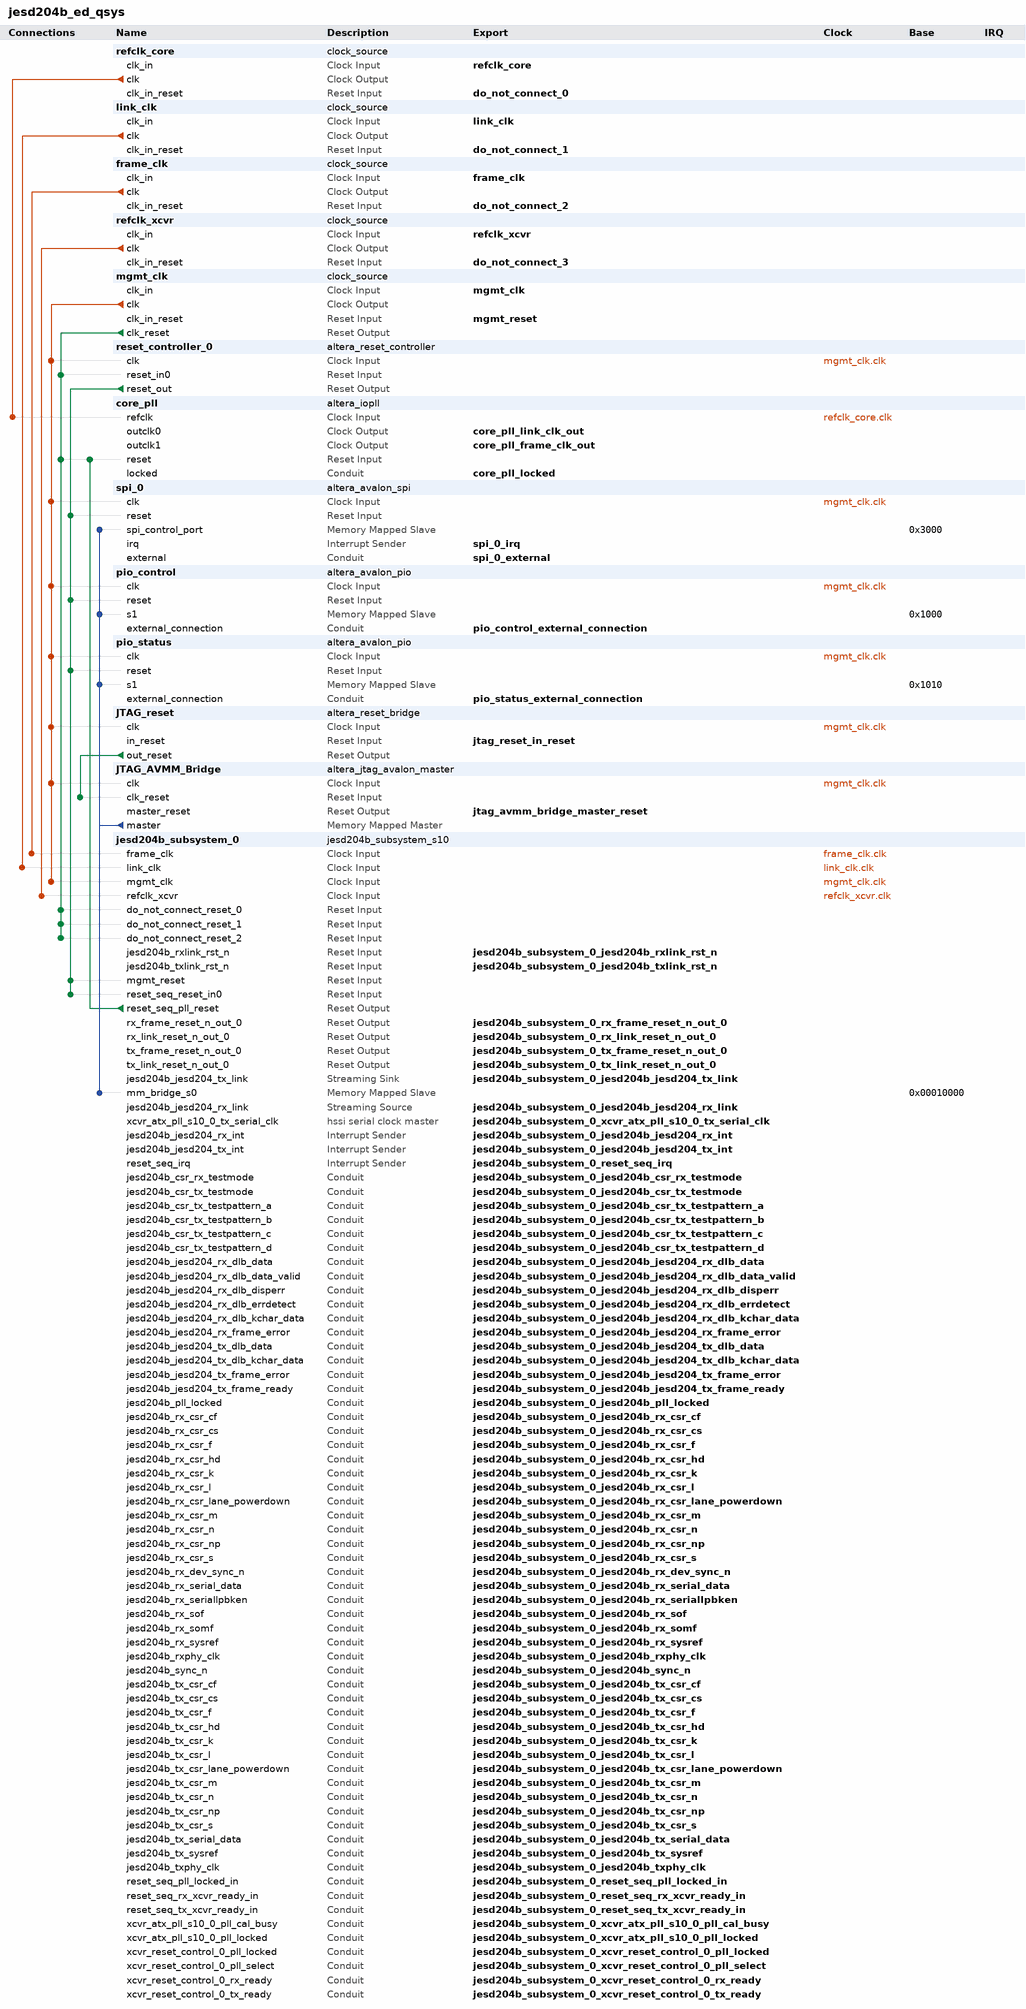
[diagram p0: system contents]
# Platform Designer (Qsys) system jesd204b_ed_qsys, Stratix 10 1SG280LN3F43E1VG
# Parameters at their usual value, and those the tool derives, are not listed.
package require -exact qsys 1.0
create_system jesd204b_ed_qsys
set_project_property DEVICE_FAMILY {Stratix 10}
set_project_property DEVICE 1SG280LN3F43E1VG

add_component refclk_core ip/jesd204b_ed_qsys/jesd204b_ed_qsys_clk_0.ip clock_source refclk_core 
load_component refclk_core
set_component_parameter_value clockFrequency 153600000
set_component_parameter_value resetSynchronousEdges DEASSERT
save_component

add_component link_clk ip/jesd204b_ed_qsys/jesd204b_ed_qsys_clk_1.ip clock_source link_clk 
load_component link_clk
set_component_parameter_value clockFrequency 153600000
set_component_parameter_value resetSynchronousEdges DEASSERT
save_component

add_component frame_clk ip/jesd204b_ed_qsys/jesd204b_ed_qsys_clk_2.ip clock_source frame_clk 
load_component frame_clk
set_component_parameter_value clockFrequency 153600000
set_component_parameter_value resetSynchronousEdges DEASSERT
save_component

add_component refclk_xcvr ip/jesd204b_ed_qsys/jesd204b_ed_qsys_clk_4.ip clock_source refclk_xcvr 
load_component refclk_xcvr
set_component_parameter_value clockFrequency 153600000
save_component

add_component mgmt_clk ip/jesd204b_ed_qsys/jesd204b_ed_qsys_clk_3.ip clock_source mgmt_clk 
load_component mgmt_clk
set_component_parameter_value clockFrequency 100000000
set_component_parameter_value resetSynchronousEdges DEASSERT
save_component

add_component reset_controller_0 ip/jesd204b_ed_qsys/jesd204b_ed_qsys_reset_controller_0.ip altera_reset_controller reset_controller_0 16.1
load_component reset_controller_0
set_component_parameter_value NUM_RESET_INPUTS 1
set_component_parameter_value SYNC_DEPTH 2
set_component_parameter_value ADAPT_RESET_REQUEST 0
save_component

add_component core_pll ip/jesd204b_ed_qsys/jesd204b_ed_qsys_iopll_0.ip altera_iopll core_pll 16.1
load_component core_pll
set_component_parameter_value gui_device_family {Stratix 10}
set_component_parameter_value gui_device_component 1SG280LN3F43E1VG
set_component_parameter_value gui_device_speed_grade 1
set_component_parameter_value hp_device_speed_grade 1
set_component_parameter_value gui_debug_mode false
set_component_parameter_value gui_include_iossm false
set_component_parameter_value gui_cal_code_hex_file seq_cal.hex
set_component_parameter_value gui_parameter_table_hex_file seq_params_sim.hex
set_component_parameter_value gui_pll_tclk_mux_en false
set_component_parameter_value gui_pll_tclk_sel pll_tclk_m_src
set_component_parameter_value gui_pll_type S10_Simple
set_component_parameter_value gui_pll_m_cnt_in_src c_m_cnt_in_src_ph_mux_clk
set_component_parameter_value gui_c_cnt_in_src0 c_m_cnt_in_src_ph_mux_clk
set_component_parameter_value gui_c_cnt_in_src1 c_m_cnt_in_src_ph_mux_clk
set_component_parameter_value system_info_device_family {Stratix 10}
set_component_parameter_value system_info_device_component 1SG280LN3F43E1VG
set_component_parameter_value system_info_device_speed_grade 1
set_component_parameter_value system_part_trait_speed_grade 1
set_component_parameter_value gui_reference_clock_frequency 153.6
set_component_parameter_value gui_use_locked true
set_component_parameter_value gui_lock_setting {Low Lock Time}
set_component_parameter_value gui_en_lvds_ports Disabled
set_component_parameter_value gui_operation_mode {source synchronous}
set_component_parameter_value gui_clock_to_compensate 0
set_component_parameter_value gui_use_NDFB_modes false
set_component_parameter_value gui_number_of_clocks 2
set_component_parameter_value gui_vco_frequency 600.0
set_component_parameter_value gui_mif_gen_options {Create MIF file during IP Generation}
set_component_parameter_value gui_new_mif_file_path {~/pll.mif}
set_component_parameter_value gui_existing_mif_file_path {~/pll.mif}
set_component_parameter_value gui_mif_config_name unnamed
set_component_parameter_value gui_clock_name_global false
set_component_parameter_value gui_clock_name_string0 link_clk
set_component_parameter_value gui_clock_name_string1 frame_clk
set_component_parameter_value gui_output_clock_frequency0 153.6
set_component_parameter_value gui_output_clock_frequency1 153.6
set_component_parameter_value gui_actual_output_clock_frequency0 100.0
set_component_parameter_value gui_actual_output_clock_frequency1 100.0
set_component_parameter_value gui_actual_phase_shift0 0.0
set_component_parameter_value gui_actual_phase_shift1 0.0
set_component_parameter_value gui_actual_phase_shift_deg0 0.0
set_component_parameter_value gui_actual_phase_shift_deg1 0.0
set_component_parameter_value gui_actual_duty_cycle0 50.0
set_component_parameter_value gui_actual_duty_cycle1 50.0
set_component_parameter_value parameterTable_names {M-Counter Divide Setting,N-Counter Divide Setting,VCO Frequency,C-Counter-0 Divide Setting,C-Counter-1 Divide Setting,C-Counter-2 Divide Setting,C-Counter-3 Divide Setting,C-Counter-4 Divide Setting,C-Counter-5 Divide Setting,C-Counter-6 Divide Setting,C-Counter-7 Divide Setting,C-Counter-8 Divide Setting,PLL Auto Reset,M-Counter Hi Divide,M-Counter Lo Divide,M-Counter Even Duty Enable,M-Counter Bypass Enable,N-Counter Hi Divide,N-Counter Lo Divide,N-Counter Even Duty Enable,N-Counter Bypass Enable,C-Counter-0 Hi Divide,C-Counter-1 Hi Divide,C-Counter-2 Hi Divide,C-Counter-3 Hi Divide,C-Counter-4 Hi Divide,C-Counter-5 Hi Divide,C-Counter-6 Hi Divide,C-Counter-7 Hi Divide,C-Counter-8 Hi Divide,C-Counter-0 Lo Divide,C-Counter-1 Lo Divide,C-Counter-2 Lo Divide,C-Counter-3 Lo Divide,C-Counter-4 Lo Divide,C-Counter-5 Lo Divide,C-Counter-6 Lo Divide,C-Counter-7 Lo Divide,C-Counter-8 Lo Divide,C-Counter-0 Even Duty Enable,C-Counter-1 Even Duty Enable,C-Counter-2 Even Duty Enable,C-Counter-3 Even Duty Enable,C-Counter-4 Even Duty Enable,C-Counter-5 Even Duty Enable,C-Counter-6 Even Duty Enable,C-Counter-7 Even Duty Enable,C-Counter-8 Even Duty Enable,C-Counter-0 Bypass Enable,C-Counter-1 Bypass Enable,C-Counter-2 Bypass Enable,C-Counter-3 Bypass Enable,C-Counter-4 Bypass Enable,C-Counter-5 Bypass Enable,C-Counter-6 Bypass Enable,C-Counter-7 Bypass Enable,C-Counter-8 Bypass Enable,C-Counter-0 Preset,C-Counter-1 Preset,C-Counter-2 Preset,C-Counter-3 Preset,C-Counter-4 Preset,C-Counter-5 Preset,C-Counter-6 Preset,C-Counter-7 Preset,C-Counter-8 Preset,C-Counter-0 Phase Mux Preset,C-Counter-1 Phase Mux Preset,C-Counter-2 Phase Mux Preset,C-Counter-3 Phase Mux Preset,C-Counter-4 Phase Mux Preset,C-Counter-5 Phase Mux Preset,C-Counter-6 Phase Mux Preset,C-Counter-7 Phase Mux Preset,C-Counter-8 Phase Mux Preset,Charge Pump Current,Bandwidth Control}
set_component_parameter_value parameterTable_values {4,1,614.400000 MHz,4,4,1,1,1,1,1,1,1,false,2,2,false,false,256,256,false,true,2,2,256,256,256,256,256,256,256,2,2,256,256,256,256,256,256,256,false,false,false,false,false,false,false,false,false,false,false,true,true,true,true,true,true,true,1,1,1,1,1,1,1,1,1,0,0,0,0,0,0,0,0,0,pll_cp_setting1,pll_bw_res_setting2}
set_component_parameter_value pll_m_cnt_basic 1
set_component_parameter_value pll_m_cnt 1
set_component_parameter_value m_cnt_hi_div 2
set_component_parameter_value m_cnt_lo_div 2
set_component_parameter_value n_cnt_hi_div 256
set_component_parameter_value n_cnt_lo_div 256
set_component_parameter_value m_cnt_bypass_en false
set_component_parameter_value n_cnt_bypass_en true
set_component_parameter_value m_cnt_odd_div_duty_en false
set_component_parameter_value n_cnt_odd_div_duty_en false
set_component_parameter_value pll_vco_div 1
set_component_parameter_value pll_cp_current pll_cp_setting1
set_component_parameter_value pll_bwctrl pll_bw_res_setting2
set_component_parameter_value pll_fractional_division 1
set_component_parameter_value fractional_vco_multiplier false
set_component_parameter_value reference_clock_frequency {153.6 MHz}
set_component_parameter_value pll_fractional_cout 1
set_component_parameter_value pll_dsm_out_sel 1st_order
set_component_parameter_value operation_mode source_synchronous
set_component_parameter_value number_of_clocks 2
set_component_parameter_value pll_vcoph_div 1
set_component_parameter_value pll_type S10_Simple
set_component_parameter_value pll_subtype General
set_component_parameter_value pll_output_clk_frequency {614.400000 MHz}
set_component_parameter_value mimic_fbclk_type gclk
set_component_parameter_value pll_bw_sel Low
set_component_parameter_value pll_slf_rst false
set_component_parameter_value pll_fbclk_mux_1 pll_fbclk_mux_1_glb
set_component_parameter_value pll_fbclk_mux_2 pll_fbclk_mux_2_fb_1
set_component_parameter_value pll_m_cnt_in_src c_m_cnt_in_src_ph_mux_clk
set_component_parameter_value pll_clkin_0_src clk_0
set_component_parameter_value refclk1_frequency {100.0 MHz}
set_component_parameter_value pll_clk_loss_sw_en false
set_component_parameter_value pll_manu_clk_sw_en false
set_component_parameter_value pll_auto_clk_sw_en false
set_component_parameter_value pll_clkin_1_src clk_0
set_component_parameter_value pll_clk_sw_dly 0
set_component_parameter_value pll_extclk_0_cnt_src pll_extclk_cnt_src_vss
set_component_parameter_value pll_extclk_1_cnt_src pll_extclk_cnt_src_vss
set_component_parameter_value pll_lock_fltr_cfg 100
set_component_parameter_value pll_unlock_fltr_cfg 2
set_component_parameter_value clock_to_compensate 0
set_component_parameter_value clock_name_global false
set_component_parameter_value c_cnt_hi_div0 2
set_component_parameter_value c_cnt_hi_div1 2
set_component_parameter_value c_cnt_hi_div2 256
set_component_parameter_value c_cnt_hi_div3 256
set_component_parameter_value c_cnt_hi_div4 256
set_component_parameter_value c_cnt_hi_div5 256
set_component_parameter_value c_cnt_hi_div6 256
set_component_parameter_value c_cnt_hi_div7 256
set_component_parameter_value c_cnt_hi_div8 256
set_component_parameter_value c_cnt_hi_div9 1
set_component_parameter_value c_cnt_hi_div10 1
set_component_parameter_value c_cnt_hi_div11 1
set_component_parameter_value c_cnt_hi_div12 1
set_component_parameter_value c_cnt_hi_div13 1
set_component_parameter_value c_cnt_hi_div14 1
set_component_parameter_value c_cnt_hi_div15 1
set_component_parameter_value c_cnt_hi_div16 1
set_component_parameter_value c_cnt_hi_div17 1
set_component_parameter_value c_cnt_lo_div0 2
set_component_parameter_value c_cnt_lo_div1 2
set_component_parameter_value c_cnt_lo_div2 256
set_component_parameter_value c_cnt_lo_div3 256
set_component_parameter_value c_cnt_lo_div4 256
set_component_parameter_value c_cnt_lo_div5 256
set_component_parameter_value c_cnt_lo_div6 256
set_component_parameter_value c_cnt_lo_div7 256
set_component_parameter_value c_cnt_lo_div8 256
set_component_parameter_value c_cnt_lo_div9 1
set_component_parameter_value c_cnt_lo_div10 1
set_component_parameter_value c_cnt_lo_div11 1
set_component_parameter_value c_cnt_lo_div12 1
set_component_parameter_value c_cnt_lo_div13 1
set_component_parameter_value c_cnt_lo_div14 1
set_component_parameter_value c_cnt_lo_div15 1
set_component_parameter_value c_cnt_lo_div16 1
set_component_parameter_value c_cnt_lo_div17 1
set_component_parameter_value c_cnt_prst0 1
set_component_parameter_value c_cnt_prst1 1
set_component_parameter_value c_cnt_prst2 1
set_component_parameter_value c_cnt_prst3 1
set_component_parameter_value c_cnt_prst4 1
set_component_parameter_value c_cnt_prst5 1
set_component_parameter_value c_cnt_prst6 1
set_component_parameter_value c_cnt_prst7 1
set_component_parameter_value c_cnt_prst8 1
set_component_parameter_value c_cnt_prst9 1
set_component_parameter_value c_cnt_prst10 1
set_component_parameter_value c_cnt_prst11 1
set_component_parameter_value c_cnt_prst12 1
set_component_parameter_value c_cnt_prst13 1
set_component_parameter_value c_cnt_prst14 1
set_component_parameter_value c_cnt_prst15 1
set_component_parameter_value c_cnt_prst16 1
set_component_parameter_value c_cnt_prst17 1
set_component_parameter_value c_cnt_ph_mux_prst0 0
set_component_parameter_value c_cnt_ph_mux_prst1 0
set_component_parameter_value c_cnt_ph_mux_prst2 0
set_component_parameter_value c_cnt_ph_mux_prst3 0
set_component_parameter_value c_cnt_ph_mux_prst4 0
set_component_parameter_value c_cnt_ph_mux_prst5 0
set_component_parameter_value c_cnt_ph_mux_prst6 0
set_component_parameter_value c_cnt_ph_mux_prst7 0
set_component_parameter_value c_cnt_ph_mux_prst8 0
set_component_parameter_value c_cnt_ph_mux_prst9 0
set_component_parameter_value c_cnt_ph_mux_prst10 0
set_component_parameter_value c_cnt_ph_mux_prst11 0
set_component_parameter_value c_cnt_ph_mux_prst12 0
set_component_parameter_value c_cnt_ph_mux_prst13 0
set_component_parameter_value c_cnt_ph_mux_prst14 0
set_component_parameter_value c_cnt_ph_mux_prst15 0
set_component_parameter_value c_cnt_ph_mux_prst16 0
set_component_parameter_value c_cnt_ph_mux_prst17 0
set_component_parameter_value c_cnt_in_src0 c_m_cnt_in_src_ph_mux_clk
set_component_parameter_value c_cnt_in_src1 c_m_cnt_in_src_ph_mux_clk
set_component_parameter_value c_cnt_in_src2 c_m_cnt_in_src_ph_mux_clk
set_component_parameter_value c_cnt_in_src3 c_m_cnt_in_src_ph_mux_clk
set_component_parameter_value c_cnt_in_src4 c_m_cnt_in_src_ph_mux_clk
set_component_parameter_value c_cnt_in_src5 c_m_cnt_in_src_ph_mux_clk
set_component_parameter_value c_cnt_in_src6 c_m_cnt_in_src_ph_mux_clk
set_component_parameter_value c_cnt_in_src7 c_m_cnt_in_src_ph_mux_clk
set_component_parameter_value c_cnt_in_src8 c_m_cnt_in_src_ph_mux_clk
set_component_parameter_value c_cnt_in_src9 c_m_cnt_in_src_ph_mux_clk
set_component_parameter_value c_cnt_in_src10 c_m_cnt_in_src_ph_mux_clk
set_component_parameter_value c_cnt_in_src11 c_m_cnt_in_src_ph_mux_clk
set_component_parameter_value c_cnt_in_src12 c_m_cnt_in_src_ph_mux_clk
set_component_parameter_value c_cnt_in_src13 c_m_cnt_in_src_ph_mux_clk
set_component_parameter_value c_cnt_in_src14 c_m_cnt_in_src_ph_mux_clk
set_component_parameter_value c_cnt_in_src15 c_m_cnt_in_src_ph_mux_clk
set_component_parameter_value c_cnt_in_src16 c_m_cnt_in_src_ph_mux_clk
set_component_parameter_value c_cnt_in_src17 c_m_cnt_in_src_ph_mux_clk
set_component_parameter_value c_cnt_bypass_en0 false
set_component_parameter_value c_cnt_bypass_en1 false
set_component_parameter_value c_cnt_bypass_en2 true
set_component_parameter_value c_cnt_bypass_en3 true
set_component_parameter_value c_cnt_bypass_en4 true
set_component_parameter_value c_cnt_bypass_en5 true
set_component_parameter_value c_cnt_bypass_en6 true
set_component_parameter_value c_cnt_bypass_en7 true
set_component_parameter_value c_cnt_bypass_en8 true
set_component_parameter_value c_cnt_bypass_en9 true
set_component_parameter_value c_cnt_bypass_en10 true
set_component_parameter_value c_cnt_bypass_en11 true
set_component_parameter_value c_cnt_bypass_en12 true
set_component_parameter_value c_cnt_bypass_en13 true
set_component_parameter_value c_cnt_bypass_en14 true
set_component_parameter_value c_cnt_bypass_en15 true
set_component_parameter_value c_cnt_bypass_en16 true
set_component_parameter_value c_cnt_bypass_en17 true
set_component_parameter_value c_cnt_odd_div_duty_en0 false
set_component_parameter_value c_cnt_odd_div_duty_en1 false
set_component_parameter_value c_cnt_odd_div_duty_en2 false
set_component_parameter_value c_cnt_odd_div_duty_en3 false
set_component_parameter_value c_cnt_odd_div_duty_en4 false
set_component_parameter_value c_cnt_odd_div_duty_en5 false
set_component_parameter_value c_cnt_odd_div_duty_en6 false
set_component_parameter_value c_cnt_odd_div_duty_en7 false
set_component_parameter_value c_cnt_odd_div_duty_en8 false
set_component_parameter_value c_cnt_odd_div_duty_en9 false
set_component_parameter_value c_cnt_odd_div_duty_en10 false
set_component_parameter_value c_cnt_odd_div_duty_en11 false
set_component_parameter_value c_cnt_odd_div_duty_en12 false
set_component_parameter_value c_cnt_odd_div_duty_en13 false
set_component_parameter_value c_cnt_odd_div_duty_en14 false
set_component_parameter_value c_cnt_odd_div_duty_en15 false
set_component_parameter_value c_cnt_odd_div_duty_en16 false
set_component_parameter_value c_cnt_odd_div_duty_en17 false
set_component_parameter_value output_clock_frequency0 {153.600000 MHz}
set_component_parameter_value output_clock_frequency1 {153.600000 MHz}
set_component_parameter_value output_clock_frequency2 {0 ps}
set_component_parameter_value output_clock_frequency3 {0 ps}
set_component_parameter_value output_clock_frequency4 {0 ps}
set_component_parameter_value output_clock_frequency5 {0 ps}
set_component_parameter_value output_clock_frequency6 {0 ps}
set_component_parameter_value output_clock_frequency7 {0 ps}
set_component_parameter_value output_clock_frequency8 {0 ps}
set_component_parameter_value output_clock_frequency9 {0 MHz}
set_component_parameter_value output_clock_frequency10 {0 MHz}
set_component_parameter_value output_clock_frequency11 {0 MHz}
set_component_parameter_value output_clock_frequency12 {0 MHz}
set_component_parameter_value output_clock_frequency13 {0 MHz}
set_component_parameter_value output_clock_frequency14 {0 MHz}
set_component_parameter_value output_clock_frequency15 {0 MHz}
set_component_parameter_value output_clock_frequency16 {0 MHz}
set_component_parameter_value output_clock_frequency17 {0 MHz}
set_component_parameter_value phase_shift0 {0 ps}
set_component_parameter_value phase_shift1 {0 ps}
set_component_parameter_value phase_shift2 {0 ps}
set_component_parameter_value phase_shift3 {0 ps}
set_component_parameter_value phase_shift4 {0 ps}
set_component_parameter_value phase_shift5 {0 ps}
set_component_parameter_value phase_shift6 {0 ps}
set_component_parameter_value phase_shift7 {0 ps}
set_component_parameter_value phase_shift8 {0 ps}
set_component_parameter_value phase_shift9 {0 ps}
set_component_parameter_value phase_shift10 {0 ps}
set_component_parameter_value phase_shift11 {0 ps}
set_component_parameter_value phase_shift12 {0 ps}
set_component_parameter_value phase_shift13 {0 ps}
set_component_parameter_value phase_shift14 {0 ps}
set_component_parameter_value phase_shift15 {0 ps}
set_component_parameter_value phase_shift16 {0 ps}
set_component_parameter_value phase_shift17 {0 ps}
set_component_parameter_value duty_cycle0 50
set_component_parameter_value duty_cycle1 50
set_component_parameter_value duty_cycle2 50
set_component_parameter_value duty_cycle3 50
set_component_parameter_value duty_cycle4 50
set_component_parameter_value duty_cycle5 50
set_component_parameter_value duty_cycle6 50
set_component_parameter_value duty_cycle7 50
set_component_parameter_value duty_cycle8 50
set_component_parameter_value duty_cycle9 50
set_component_parameter_value duty_cycle10 50
set_component_parameter_value duty_cycle11 50
set_component_parameter_value duty_cycle12 50
set_component_parameter_value duty_cycle13 50
set_component_parameter_value duty_cycle14 50
set_component_parameter_value duty_cycle15 50
set_component_parameter_value duty_cycle16 50
set_component_parameter_value duty_cycle17 50
set_component_parameter_value clock_name_0 link_clk
set_component_parameter_value clock_name_1 frame_clk
set_component_parameter_value clock_name_global_0 false
set_component_parameter_value clock_name_global_1 false
set_component_parameter_value clock_name_global_2 false
set_component_parameter_value clock_name_global_3 false
set_component_parameter_value clock_name_global_4 false
set_component_parameter_value clock_name_global_5 false
set_component_parameter_value clock_name_global_6 false
set_component_parameter_value clock_name_global_7 false
set_component_parameter_value clock_name_global_8 false
set_component_parameter_value pll_tclk_mux_en false
set_component_parameter_value pll_tclk_sel pll_tclk_m_src
set_component_parameter_value include_iossm false
set_component_parameter_value cal_code_hex_file seq_cal.hex
set_component_parameter_value parameter_table_hex_file seq_params_sim.hex
set_component_parameter_value iossm_nios_sim_clk_period_ps 1333
set_component_parameter_value hp_number_of_family_allowable_clocks 9
set_component_parameter_value hp_number_of_clocks_used_by_cascading 0
set_component_parameter_value hp_actual_vco_frequency 600.0
set_component_parameter_value hp_user_selected_num_clocks 1
set_component_parameter_value hp_initialization_validation_performed true
set_component_parameter_value gui_compensation_mode {source synchronous}
set_component_parameter_value new_dropdown_selection false
set_component_parameter_value hp_number_of_clocks 2
set_component_parameter_value hp_actual_frequency0 153.59999999999997
set_component_parameter_value hp_actual_frequency1 153.6
set_component_parameter_value hp_actual_frequency2 100.0
set_component_parameter_value hp_actual_frequency3 100.0
set_component_parameter_value hp_actual_frequency4 100.0
set_component_parameter_value hp_actual_frequency5 100.0
set_component_parameter_value hp_actual_frequency6 100.0
set_component_parameter_value hp_actual_frequency7 100.0
set_component_parameter_value hp_actual_frequency8 100.0
set_component_parameter_value hp_actual_frequency9 100.0
set_component_parameter_value hp_actual_frequency10 100.0
set_component_parameter_value hp_actual_frequency11 100.0
set_component_parameter_value hp_actual_frequency12 100.0
set_component_parameter_value hp_actual_frequency13 100.0
set_component_parameter_value hp_actual_frequency14 100.0
set_component_parameter_value hp_actual_frequency15 100.0
set_component_parameter_value hp_actual_frequency16 100.0
set_component_parameter_value hp_actual_frequency17 100.0
set_component_parameter_value hp_actual_phase0 0.0
set_component_parameter_value hp_actual_phase1 0.0
set_component_parameter_value hp_actual_phase2 0.0
set_component_parameter_value hp_actual_phase3 0.0
set_component_parameter_value hp_actual_phase4 0.0
set_component_parameter_value hp_actual_phase5 0.0
set_component_parameter_value hp_actual_phase6 0.0
set_component_parameter_value hp_actual_phase7 0.0
set_component_parameter_value hp_actual_phase8 0.0
set_component_parameter_value hp_actual_phase9 0.0
set_component_parameter_value hp_actual_phase10 0.0
set_component_parameter_value hp_actual_phase11 0.0
set_component_parameter_value hp_actual_phase12 0.0
set_component_parameter_value hp_actual_phase13 0.0
set_component_parameter_value hp_actual_phase14 0.0
set_component_parameter_value hp_actual_phase15 0.0
set_component_parameter_value hp_actual_phase16 0.0
set_component_parameter_value hp_actual_phase17 0.0
set_component_parameter_value hp_actual_duty0 50.0
set_component_parameter_value hp_actual_duty1 50.0
set_component_parameter_value hp_actual_duty2 50.0
set_component_parameter_value hp_actual_duty3 50.0
set_component_parameter_value hp_actual_duty4 50.0
set_component_parameter_value hp_actual_duty5 50.0
set_component_parameter_value hp_actual_duty6 50.0
set_component_parameter_value hp_actual_duty7 50.0
set_component_parameter_value hp_actual_duty8 50.0
set_component_parameter_value hp_actual_duty9 50.0
set_component_parameter_value hp_actual_duty10 50.0
set_component_parameter_value hp_actual_duty11 50.0
set_component_parameter_value hp_actual_duty12 50.0
set_component_parameter_value hp_actual_duty13 50.0
set_component_parameter_value hp_actual_duty14 50.0
set_component_parameter_value hp_actual_duty15 50.0
set_component_parameter_value hp_actual_duty16 50.0
set_component_parameter_value hp_actual_duty17 50.0
set_component_parameter_value hp_actual_chain_length0 1
set_component_parameter_value hp_actual_chain_length1 1
set_component_parameter_value hp_actual_chain_length2 1
set_component_parameter_value hp_actual_chain_length3 1
set_component_parameter_value hp_actual_chain_length4 1
set_component_parameter_value hp_actual_chain_length5 1
set_component_parameter_value hp_actual_chain_length6 1
set_component_parameter_value hp_actual_chain_length7 1
set_component_parameter_value hp_actual_chain_length8 1
set_component_parameter_value hp_actual_chain_length9 1
set_component_parameter_value hp_actual_chain_length10 1
set_component_parameter_value hp_actual_chain_length11 1
set_component_parameter_value hp_actual_chain_length12 1
set_component_parameter_value hp_actual_chain_length13 1
set_component_parameter_value hp_actual_chain_length14 1
set_component_parameter_value hp_actual_chain_length15 1
set_component_parameter_value hp_actual_chain_length16 1
set_component_parameter_value hp_actual_chain_length17 1
save_component

add_component spi_0 ip/jesd204b_ed_qsys/jesd204b_ed_qsys_spi_0.ip altera_avalon_spi spi_0 16.1
load_component spi_0
set_component_parameter_value clockPolarity 0
set_component_parameter_value dataWidth 24
set_component_parameter_value masterSPI true
set_component_parameter_value numberOfSlaves 3
set_component_parameter_value targetClockRate 20000000
save_component

add_component pio_control ip/jesd204b_ed_qsys/jesd204b_ed_qsys_pio_0.ip altera_avalon_pio pio_control 16.1
load_component pio_control
set_component_parameter_value direction Output
set_component_parameter_value width 32
save_component

add_component pio_status ip/jesd204b_ed_qsys/jesd204b_ed_qsys_pio_1.ip altera_avalon_pio pio_status 16.1
load_component pio_status
set_component_parameter_value direction Input
set_component_parameter_value width 32
save_component

add_component JTAG_reset ip/jesd204b_ed_qsys/jesd204b_ed_qsys_reset_bridge_0.ip altera_reset_bridge JTAG_reset 16.1
load_component JTAG_reset
set_component_parameter_value ACTIVE_LOW_RESET 1
set_component_parameter_value SYNCHRONOUS_EDGES deassert
save_component

add_component JTAG_AVMM_Bridge ip/jesd204b_ed_qsys/jesd204b_ed_qsys_master_0.ip altera_jtag_avalon_master JTAG_AVMM_Bridge 16.1
load_component JTAG_AVMM_Bridge
save_component

add_instance jesd204b_subsystem_0 jesd204b_subsystem_s10 1.0

# connections
add_connection frame_clk.clk jesd204b_subsystem_0.frame_clk clock
add_connection link_clk.clk jesd204b_subsystem_0.link_clk clock
add_connection mgmt_clk.clk jesd204b_subsystem_0.mgmt_clk clock
add_connection mgmt_clk.clk JTAG_AVMM_Bridge.clk clock
add_connection mgmt_clk.clk JTAG_reset.clk clock
add_connection mgmt_clk.clk pio_control.clk clock
add_connection mgmt_clk.clk pio_status.clk clock
add_connection mgmt_clk.clk reset_controller_0.clk clock
add_connection mgmt_clk.clk spi_0.clk clock
add_connection refclk_core.clk core_pll.refclk clock
add_connection refclk_xcvr.clk jesd204b_subsystem_0.refclk_xcvr clock
add_connection jesd204b_subsystem_0.reset_seq_pll_reset core_pll.reset reset
add_connection JTAG_reset.out_reset JTAG_AVMM_Bridge.clk_reset reset
add_connection mgmt_clk.clk_reset core_pll.reset reset
add_connection mgmt_clk.clk_reset jesd204b_subsystem_0.do_not_connect_reset_0 reset
add_connection mgmt_clk.clk_reset jesd204b_subsystem_0.do_not_connect_reset_1 reset
add_connection mgmt_clk.clk_reset jesd204b_subsystem_0.do_not_connect_reset_2 reset
add_connection mgmt_clk.clk_reset reset_controller_0.reset_in0 reset
add_connection reset_controller_0.reset_out jesd204b_subsystem_0.mgmt_reset reset
add_connection reset_controller_0.reset_out jesd204b_subsystem_0.reset_seq_reset_in0 reset
add_connection reset_controller_0.reset_out pio_control.reset reset
add_connection reset_controller_0.reset_out pio_status.reset reset
add_connection reset_controller_0.reset_out spi_0.reset reset
add_connection JTAG_AVMM_Bridge.master jesd204b_subsystem_0.mm_bridge_s0 avalon
set_connection_parameter_value JTAG_AVMM_Bridge.master/jesd204b_subsystem_0.mm_bridge_s0 baseAddress 0x00010000
add_connection JTAG_AVMM_Bridge.master pio_control.s1 avalon
set_connection_parameter_value JTAG_AVMM_Bridge.master/pio_control.s1 baseAddress 0x1000
add_connection JTAG_AVMM_Bridge.master pio_status.s1 avalon
set_connection_parameter_value JTAG_AVMM_Bridge.master/pio_status.s1 baseAddress 0x1010
add_connection JTAG_AVMM_Bridge.master spi_0.spi_control_port avalon
set_connection_parameter_value JTAG_AVMM_Bridge.master/spi_0.spi_control_port baseAddress 0x3000

# exported interfaces
add_interface core_pll_frame_clk_out clock source
set_interface_property core_pll_frame_clk_out EXPORT_OF core_pll.outclk1
add_interface core_pll_link_clk_out clock source
set_interface_property core_pll_link_clk_out EXPORT_OF core_pll.outclk0
add_interface core_pll_locked conduit end
set_interface_property core_pll_locked EXPORT_OF core_pll.locked
add_interface do_not_connect_0 reset sink
set_interface_property do_not_connect_0 EXPORT_OF refclk_core.clk_in_reset
add_interface do_not_connect_1 reset sink
set_interface_property do_not_connect_1 EXPORT_OF link_clk.clk_in_reset
add_interface do_not_connect_2 reset sink
set_interface_property do_not_connect_2 EXPORT_OF frame_clk.clk_in_reset
add_interface do_not_connect_3 reset sink
set_interface_property do_not_connect_3 EXPORT_OF refclk_xcvr.clk_in_reset
add_interface frame_clk clock sink
set_interface_property frame_clk EXPORT_OF frame_clk.clk_in
add_interface jesd204b_subsystem_0_jesd204b_csr_rx_testmode conduit end
set_interface_property jesd204b_subsystem_0_jesd204b_csr_rx_testmode EXPORT_OF jesd204b_subsystem_0.jesd204b_csr_rx_testmode
add_interface jesd204b_subsystem_0_jesd204b_csr_tx_testmode conduit end
set_interface_property jesd204b_subsystem_0_jesd204b_csr_tx_testmode EXPORT_OF jesd204b_subsystem_0.jesd204b_csr_tx_testmode
add_interface jesd204b_subsystem_0_jesd204b_csr_tx_testpattern_a conduit end
set_interface_property jesd204b_subsystem_0_jesd204b_csr_tx_testpattern_a EXPORT_OF jesd204b_subsystem_0.jesd204b_csr_tx_testpattern_a
add_interface jesd204b_subsystem_0_jesd204b_csr_tx_testpattern_b conduit end
set_interface_property jesd204b_subsystem_0_jesd204b_csr_tx_testpattern_b EXPORT_OF jesd204b_subsystem_0.jesd204b_csr_tx_testpattern_b
add_interface jesd204b_subsystem_0_jesd204b_csr_tx_testpattern_c conduit end
set_interface_property jesd204b_subsystem_0_jesd204b_csr_tx_testpattern_c EXPORT_OF jesd204b_subsystem_0.jesd204b_csr_tx_testpattern_c
add_interface jesd204b_subsystem_0_jesd204b_csr_tx_testpattern_d conduit end
set_interface_property jesd204b_subsystem_0_jesd204b_csr_tx_testpattern_d EXPORT_OF jesd204b_subsystem_0.jesd204b_csr_tx_testpattern_d
add_interface jesd204b_subsystem_0_jesd204b_jesd204_rx_dlb_data conduit end
set_interface_property jesd204b_subsystem_0_jesd204b_jesd204_rx_dlb_data EXPORT_OF jesd204b_subsystem_0.jesd204b_jesd204_rx_dlb_data
add_interface jesd204b_subsystem_0_jesd204b_jesd204_rx_dlb_data_valid conduit end
set_interface_property jesd204b_subsystem_0_jesd204b_jesd204_rx_dlb_data_valid EXPORT_OF jesd204b_subsystem_0.jesd204b_jesd204_rx_dlb_data_valid
add_interface jesd204b_subsystem_0_jesd204b_jesd204_rx_dlb_disperr conduit end
set_interface_property jesd204b_subsystem_0_jesd204b_jesd204_rx_dlb_disperr EXPORT_OF jesd204b_subsystem_0.jesd204b_jesd204_rx_dlb_disperr
add_interface jesd204b_subsystem_0_jesd204b_jesd204_rx_dlb_errdetect conduit end
set_interface_property jesd204b_subsystem_0_jesd204b_jesd204_rx_dlb_errdetect EXPORT_OF jesd204b_subsystem_0.jesd204b_jesd204_rx_dlb_errdetect
add_interface jesd204b_subsystem_0_jesd204b_jesd204_rx_dlb_kchar_data conduit end
set_interface_property jesd204b_subsystem_0_jesd204b_jesd204_rx_dlb_kchar_data EXPORT_OF jesd204b_subsystem_0.jesd204b_jesd204_rx_dlb_kchar_data
add_interface jesd204b_subsystem_0_jesd204b_jesd204_rx_frame_error conduit end
set_interface_property jesd204b_subsystem_0_jesd204b_jesd204_rx_frame_error EXPORT_OF jesd204b_subsystem_0.jesd204b_jesd204_rx_frame_error
add_interface jesd204b_subsystem_0_jesd204b_jesd204_rx_int interrupt sender
set_interface_property jesd204b_subsystem_0_jesd204b_jesd204_rx_int EXPORT_OF jesd204b_subsystem_0.jesd204b_jesd204_rx_int
add_interface jesd204b_subsystem_0_jesd204b_jesd204_rx_link avalon_streaming source
set_interface_property jesd204b_subsystem_0_jesd204b_jesd204_rx_link EXPORT_OF jesd204b_subsystem_0.jesd204b_jesd204_rx_link
add_interface jesd204b_subsystem_0_jesd204b_jesd204_tx_dlb_data conduit end
set_interface_property jesd204b_subsystem_0_jesd204b_jesd204_tx_dlb_data EXPORT_OF jesd204b_subsystem_0.jesd204b_jesd204_tx_dlb_data
add_interface jesd204b_subsystem_0_jesd204b_jesd204_tx_dlb_kchar_data conduit end
set_interface_property jesd204b_subsystem_0_jesd204b_jesd204_tx_dlb_kchar_data EXPORT_OF jesd204b_subsystem_0.jesd204b_jesd204_tx_dlb_kchar_data
add_interface jesd204b_subsystem_0_jesd204b_jesd204_tx_frame_error conduit end
set_interface_property jesd204b_subsystem_0_jesd204b_jesd204_tx_frame_error EXPORT_OF jesd204b_subsystem_0.jesd204b_jesd204_tx_frame_error
add_interface jesd204b_subsystem_0_jesd204b_jesd204_tx_frame_ready conduit end
set_interface_property jesd204b_subsystem_0_jesd204b_jesd204_tx_frame_ready EXPORT_OF jesd204b_subsystem_0.jesd204b_jesd204_tx_frame_ready
add_interface jesd204b_subsystem_0_jesd204b_jesd204_tx_int interrupt sender
set_interface_property jesd204b_subsystem_0_jesd204b_jesd204_tx_int EXPORT_OF jesd204b_subsystem_0.jesd204b_jesd204_tx_int
add_interface jesd204b_subsystem_0_jesd204b_jesd204_tx_link avalon_streaming sink
set_interface_property jesd204b_subsystem_0_jesd204b_jesd204_tx_link EXPORT_OF jesd204b_subsystem_0.jesd204b_jesd204_tx_link
add_interface jesd204b_subsystem_0_jesd204b_pll_locked conduit end
set_interface_property jesd204b_subsystem_0_jesd204b_pll_locked EXPORT_OF jesd204b_subsystem_0.jesd204b_pll_locked
add_interface jesd204b_subsystem_0_jesd204b_rx_csr_cf conduit end
set_interface_property jesd204b_subsystem_0_jesd204b_rx_csr_cf EXPORT_OF jesd204b_subsystem_0.jesd204b_rx_csr_cf
add_interface jesd204b_subsystem_0_jesd204b_rx_csr_cs conduit end
set_interface_property jesd204b_subsystem_0_jesd204b_rx_csr_cs EXPORT_OF jesd204b_subsystem_0.jesd204b_rx_csr_cs
add_interface jesd204b_subsystem_0_jesd204b_rx_csr_f conduit end
set_interface_property jesd204b_subsystem_0_jesd204b_rx_csr_f EXPORT_OF jesd204b_subsystem_0.jesd204b_rx_csr_f
add_interface jesd204b_subsystem_0_jesd204b_rx_csr_hd conduit end
set_interface_property jesd204b_subsystem_0_jesd204b_rx_csr_hd EXPORT_OF jesd204b_subsystem_0.jesd204b_rx_csr_hd
add_interface jesd204b_subsystem_0_jesd204b_rx_csr_k conduit end
set_interface_property jesd204b_subsystem_0_jesd204b_rx_csr_k EXPORT_OF jesd204b_subsystem_0.jesd204b_rx_csr_k
add_interface jesd204b_subsystem_0_jesd204b_rx_csr_l conduit end
set_interface_property jesd204b_subsystem_0_jesd204b_rx_csr_l EXPORT_OF jesd204b_subsystem_0.jesd204b_rx_csr_l
add_interface jesd204b_subsystem_0_jesd204b_rx_csr_lane_powerdown conduit end
set_interface_property jesd204b_subsystem_0_jesd204b_rx_csr_lane_powerdown EXPORT_OF jesd204b_subsystem_0.jesd204b_rx_csr_lane_powerdown
add_interface jesd204b_subsystem_0_jesd204b_rx_csr_m conduit end
set_interface_property jesd204b_subsystem_0_jesd204b_rx_csr_m EXPORT_OF jesd204b_subsystem_0.jesd204b_rx_csr_m
add_interface jesd204b_subsystem_0_jesd204b_rx_csr_n conduit end
set_interface_property jesd204b_subsystem_0_jesd204b_rx_csr_n EXPORT_OF jesd204b_subsystem_0.jesd204b_rx_csr_n
add_interface jesd204b_subsystem_0_jesd204b_rx_csr_np conduit end
set_interface_property jesd204b_subsystem_0_jesd204b_rx_csr_np EXPORT_OF jesd204b_subsystem_0.jesd204b_rx_csr_np
add_interface jesd204b_subsystem_0_jesd204b_rx_csr_s conduit end
set_interface_property jesd204b_subsystem_0_jesd204b_rx_csr_s EXPORT_OF jesd204b_subsystem_0.jesd204b_rx_csr_s
add_interface jesd204b_subsystem_0_jesd204b_rx_dev_sync_n conduit end
set_interface_property jesd204b_subsystem_0_jesd204b_rx_dev_sync_n EXPORT_OF jesd204b_subsystem_0.jesd204b_rx_dev_sync_n
add_interface jesd204b_subsystem_0_jesd204b_rx_serial_data conduit end
set_interface_property jesd204b_subsystem_0_jesd204b_rx_serial_data EXPORT_OF jesd204b_subsystem_0.jesd204b_rx_serial_data
add_interface jesd204b_subsystem_0_jesd204b_rx_seriallpbken conduit end
set_interface_property jesd204b_subsystem_0_jesd204b_rx_seriallpbken EXPORT_OF jesd204b_subsystem_0.jesd204b_rx_seriallpbken
add_interface jesd204b_subsystem_0_jesd204b_rx_sof conduit end
set_interface_property jesd204b_subsystem_0_jesd204b_rx_sof EXPORT_OF jesd204b_subsystem_0.jesd204b_rx_sof
add_interface jesd204b_subsystem_0_jesd204b_rx_somf conduit end
set_interface_property jesd204b_subsystem_0_jesd204b_rx_somf EXPORT_OF jesd204b_subsystem_0.jesd204b_rx_somf
add_interface jesd204b_subsystem_0_jesd204b_rx_sysref conduit end
set_interface_property jesd204b_subsystem_0_jesd204b_rx_sysref EXPORT_OF jesd204b_subsystem_0.jesd204b_rx_sysref
add_interface jesd204b_subsystem_0_jesd204b_rxlink_rst_n reset sink
set_interface_property jesd204b_subsystem_0_jesd204b_rxlink_rst_n EXPORT_OF jesd204b_subsystem_0.jesd204b_rxlink_rst_n
add_interface jesd204b_subsystem_0_jesd204b_rxphy_clk conduit end
set_interface_property jesd204b_subsystem_0_jesd204b_rxphy_clk EXPORT_OF jesd204b_subsystem_0.jesd204b_rxphy_clk
add_interface jesd204b_subsystem_0_jesd204b_sync_n conduit end
set_interface_property jesd204b_subsystem_0_jesd204b_sync_n EXPORT_OF jesd204b_subsystem_0.jesd204b_sync_n
add_interface jesd204b_subsystem_0_jesd204b_tx_csr_cf conduit end
set_interface_property jesd204b_subsystem_0_jesd204b_tx_csr_cf EXPORT_OF jesd204b_subsystem_0.jesd204b_tx_csr_cf
add_interface jesd204b_subsystem_0_jesd204b_tx_csr_cs conduit end
set_interface_property jesd204b_subsystem_0_jesd204b_tx_csr_cs EXPORT_OF jesd204b_subsystem_0.jesd204b_tx_csr_cs
add_interface jesd204b_subsystem_0_jesd204b_tx_csr_f conduit end
set_interface_property jesd204b_subsystem_0_jesd204b_tx_csr_f EXPORT_OF jesd204b_subsystem_0.jesd204b_tx_csr_f
add_interface jesd204b_subsystem_0_jesd204b_tx_csr_hd conduit end
set_interface_property jesd204b_subsystem_0_jesd204b_tx_csr_hd EXPORT_OF jesd204b_subsystem_0.jesd204b_tx_csr_hd
add_interface jesd204b_subsystem_0_jesd204b_tx_csr_k conduit end
set_interface_property jesd204b_subsystem_0_jesd204b_tx_csr_k EXPORT_OF jesd204b_subsystem_0.jesd204b_tx_csr_k
add_interface jesd204b_subsystem_0_jesd204b_tx_csr_l conduit end
set_interface_property jesd204b_subsystem_0_jesd204b_tx_csr_l EXPORT_OF jesd204b_subsystem_0.jesd204b_tx_csr_l
add_interface jesd204b_subsystem_0_jesd204b_tx_csr_lane_powerdown conduit end
set_interface_property jesd204b_subsystem_0_jesd204b_tx_csr_lane_powerdown EXPORT_OF jesd204b_subsystem_0.jesd204b_tx_csr_lane_powerdown
add_interface jesd204b_subsystem_0_jesd204b_tx_csr_m conduit end
set_interface_property jesd204b_subsystem_0_jesd204b_tx_csr_m EXPORT_OF jesd204b_subsystem_0.jesd204b_tx_csr_m
add_interface jesd204b_subsystem_0_jesd204b_tx_csr_n conduit end
set_interface_property jesd204b_subsystem_0_jesd204b_tx_csr_n EXPORT_OF jesd204b_subsystem_0.jesd204b_tx_csr_n
add_interface jesd204b_subsystem_0_jesd204b_tx_csr_np conduit end
set_interface_property jesd204b_subsystem_0_jesd204b_tx_csr_np EXPORT_OF jesd204b_subsystem_0.jesd204b_tx_csr_np
add_interface jesd204b_subsystem_0_jesd204b_tx_csr_s conduit end
set_interface_property jesd204b_subsystem_0_jesd204b_tx_csr_s EXPORT_OF jesd204b_subsystem_0.jesd204b_tx_csr_s
add_interface jesd204b_subsystem_0_jesd204b_tx_serial_data conduit end
set_interface_property jesd204b_subsystem_0_jesd204b_tx_serial_data EXPORT_OF jesd204b_subsystem_0.jesd204b_tx_serial_data
add_interface jesd204b_subsystem_0_jesd204b_tx_sysref conduit end
set_interface_property jesd204b_subsystem_0_jesd204b_tx_sysref EXPORT_OF jesd204b_subsystem_0.jesd204b_tx_sysref
add_interface jesd204b_subsystem_0_jesd204b_txlink_rst_n reset sink
set_interface_property jesd204b_subsystem_0_jesd204b_txlink_rst_n EXPORT_OF jesd204b_subsystem_0.jesd204b_txlink_rst_n
add_interface jesd204b_subsystem_0_jesd204b_txphy_clk conduit end
set_interface_property jesd204b_subsystem_0_jesd204b_txphy_clk EXPORT_OF jesd204b_subsystem_0.jesd204b_txphy_clk
add_interface jesd204b_subsystem_0_reset_seq_irq interrupt sender
set_interface_property jesd204b_subsystem_0_reset_seq_irq EXPORT_OF jesd204b_subsystem_0.reset_seq_irq
add_interface jesd204b_subsystem_0_reset_seq_pll_locked_in conduit end
set_interface_property jesd204b_subsystem_0_reset_seq_pll_locked_in EXPORT_OF jesd204b_subsystem_0.reset_seq_pll_locked_in
add_interface jesd204b_subsystem_0_reset_seq_rx_xcvr_ready_in conduit end
set_interface_property jesd204b_subsystem_0_reset_seq_rx_xcvr_ready_in EXPORT_OF jesd204b_subsystem_0.reset_seq_rx_xcvr_ready_in
add_interface jesd204b_subsystem_0_reset_seq_tx_xcvr_ready_in conduit end
set_interface_property jesd204b_subsystem_0_reset_seq_tx_xcvr_ready_in EXPORT_OF jesd204b_subsystem_0.reset_seq_tx_xcvr_ready_in
add_interface jesd204b_subsystem_0_rx_frame_reset_n_out_0 reset source
set_interface_property jesd204b_subsystem_0_rx_frame_reset_n_out_0 EXPORT_OF jesd204b_subsystem_0.rx_frame_reset_n_out_0
add_interface jesd204b_subsystem_0_rx_link_reset_n_out_0 reset source
set_interface_property jesd204b_subsystem_0_rx_link_reset_n_out_0 EXPORT_OF jesd204b_subsystem_0.rx_link_reset_n_out_0
add_interface jesd204b_subsystem_0_tx_frame_reset_n_out_0 reset source
set_interface_property jesd204b_subsystem_0_tx_frame_reset_n_out_0 EXPORT_OF jesd204b_subsystem_0.tx_frame_reset_n_out_0
add_interface jesd204b_subsystem_0_tx_link_reset_n_out_0 reset source
set_interface_property jesd204b_subsystem_0_tx_link_reset_n_out_0 EXPORT_OF jesd204b_subsystem_0.tx_link_reset_n_out_0
add_interface jesd204b_subsystem_0_xcvr_atx_pll_s10_0_pll_cal_busy conduit end
set_interface_property jesd204b_subsystem_0_xcvr_atx_pll_s10_0_pll_cal_busy EXPORT_OF jesd204b_subsystem_0.xcvr_atx_pll_s10_0_pll_cal_busy
add_interface jesd204b_subsystem_0_xcvr_atx_pll_s10_0_pll_locked conduit end
set_interface_property jesd204b_subsystem_0_xcvr_atx_pll_s10_0_pll_locked EXPORT_OF jesd204b_subsystem_0.xcvr_atx_pll_s10_0_pll_locked
add_interface jesd204b_subsystem_0_xcvr_atx_pll_s10_0_tx_serial_clk hssi_serial_clock start
set_interface_property jesd204b_subsystem_0_xcvr_atx_pll_s10_0_tx_serial_clk EXPORT_OF jesd204b_subsystem_0.xcvr_atx_pll_s10_0_tx_serial_clk
add_interface jesd204b_subsystem_0_xcvr_reset_control_0_pll_locked conduit end
set_interface_property jesd204b_subsystem_0_xcvr_reset_control_0_pll_locked EXPORT_OF jesd204b_subsystem_0.xcvr_reset_control_0_pll_locked
add_interface jesd204b_subsystem_0_xcvr_reset_control_0_pll_select conduit end
set_interface_property jesd204b_subsystem_0_xcvr_reset_control_0_pll_select EXPORT_OF jesd204b_subsystem_0.xcvr_reset_control_0_pll_select
add_interface jesd204b_subsystem_0_xcvr_reset_control_0_rx_ready conduit end
set_interface_property jesd204b_subsystem_0_xcvr_reset_control_0_rx_ready EXPORT_OF jesd204b_subsystem_0.xcvr_reset_control_0_rx_ready
add_interface jesd204b_subsystem_0_xcvr_reset_control_0_tx_ready conduit end
set_interface_property jesd204b_subsystem_0_xcvr_reset_control_0_tx_ready EXPORT_OF jesd204b_subsystem_0.xcvr_reset_control_0_tx_ready
add_interface jtag_avmm_bridge_master_reset reset source
set_interface_property jtag_avmm_bridge_master_reset EXPORT_OF JTAG_AVMM_Bridge.master_reset
add_interface jtag_reset_in_reset reset sink
set_interface_property jtag_reset_in_reset EXPORT_OF JTAG_reset.in_reset
add_interface link_clk clock sink
set_interface_property link_clk EXPORT_OF link_clk.clk_in
add_interface mgmt_clk clock sink
set_interface_property mgmt_clk EXPORT_OF mgmt_clk.clk_in
add_interface mgmt_reset reset sink
set_interface_property mgmt_reset EXPORT_OF mgmt_clk.clk_in_reset
add_interface pio_control_external_connection conduit end
set_interface_property pio_control_external_connection EXPORT_OF pio_control.external_connection
add_interface pio_status_external_connection conduit end
set_interface_property pio_status_external_connection EXPORT_OF pio_status.external_connection
add_interface refclk_core clock sink
set_interface_property refclk_core EXPORT_OF refclk_core.clk_in
add_interface refclk_xcvr clock sink
set_interface_property refclk_xcvr EXPORT_OF refclk_xcvr.clk_in
add_interface spi_0_external conduit end
set_interface_property spi_0_external EXPORT_OF spi_0.external
add_interface spi_0_irq interrupt sender
set_interface_property spi_0_irq EXPORT_OF spi_0.irq

set_interconnect_requirement {$system} qsys_mm.clockCrossingAdapter HANDSHAKE
set_interconnect_requirement {$system} qsys_mm.enableEccProtection FALSE
set_interconnect_requirement {$system} qsys_mm.insertDefaultSlave FALSE
set_interconnect_requirement {$system} qsys_mm.maxAdditionalLatency 1

save_system jesd204b_ed_qsys.qsys
